# Altium project SRT.PrjPcb
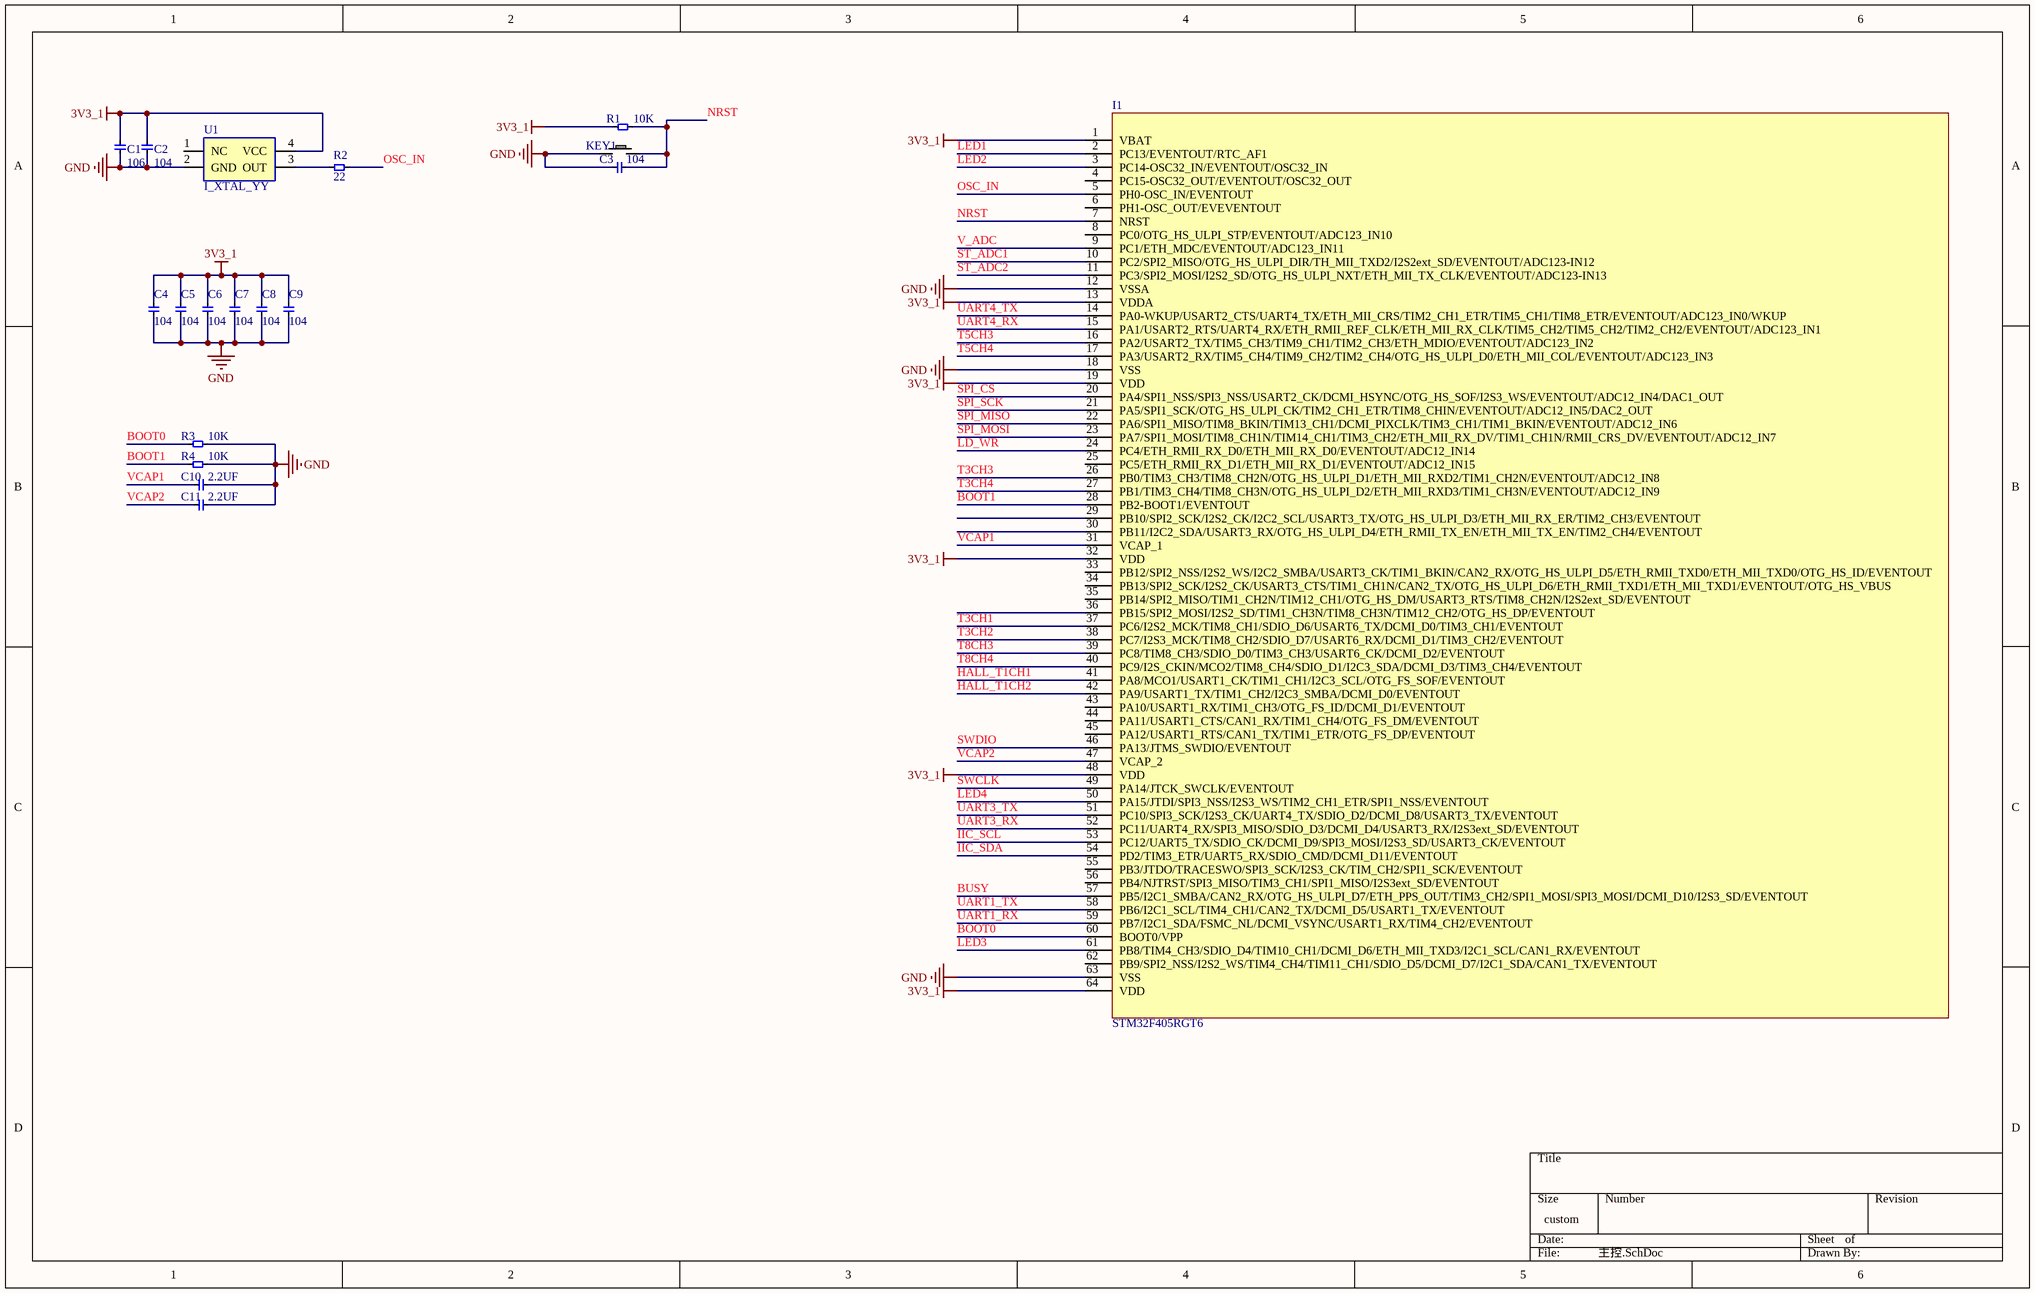
[diagram p0: 主控.SchDoc]
6 sheets, 193 parts. Net scope: global (net labels, ports and power ports of the same name join across sheets).
Board file: Srt.PcbDoc
Sheets:
  主控.SchDoc
  语音识别.SchDoc
  电机,舵机.SchDoc
  其他.SchDoc
  电源.SchDoc
  语音合成.SchDoc

## Sheet 主控.SchDoc
size 381 x 241 mm

### Parts
C1  106  [C_0603]
C2  104  [C_0603]
C3  104  [C_0603]
C4  104  [C_0603]
C5  104  [C_0603]
C6  104  [C_0603]
C7  104  [C_0603]
C8  104  [C_0603]
C9  104  [C_0603]
C10  2.2UF  [C_0603]
C11  2.2UF  [C_0603]
I1  STM32F405RGT6  [I_LQFP-64]
KEY1  KEY  [按键_小四脚]  (value not drawn)
R1  10K  [R_0603]
R2  22  [R_0603]
R3  10K  [R_0603]
R4  10K  [R_0603]
U1  I_XTAL_YY  [I_XTAL_YYSMD_3.2X2.5]

### Nets
3V3_1: C1.2 C2.2 C4.2 C5.2 C6.2 C7.2 C8.2 C9.2 I1.1(VBAT) I1.13(VDDA) I1.19(VDD) I1.32(VDD) I1.48(VDD) I1.64(VDD) R1.1 U1.4(VCC)
GND: C1.1 C2.1 C3.2 C4.1 C5.1 C6.1 C7.1 C8.1 C9.1 C10.1 C11.1 I1.12(VSSA) I1.18(VSS) I1.63(VSS) KEY1.1 R3.2 R4.2 U1.2(GND)
BOOT0: I1.60(BOOT0/VPP) R3.1
BOOT1: I1.28(PB2-BOOT1/EVENTOUT) R4.1
BUSY: I1.57(PB5/I2C1_SMBA/CAN2_RX/OTG_HS_ULPI_D7/ETH_PPS_OUT/TIM3_CH2/SPI1_MOSI/SPI3_MOSI/DCMI_D10/I2S3_SD/EVENTOUT)
HALL_T1CH1: I1.41(PA8/MCO1/USART1_CK/TIM1_CH1/I2C3_SCL/OTG_FS_SOF/EVENTOUT)
HALL_T1CH2: I1.42(PA9/USART1_TX/TIM1_CH2/I2C3_SMBA/DCMI_D0/EVENTOUT)
IIC_SCL: I1.53(PC12/UART5_TX/SDIO_CK/DCMI_D9/SPI3_MOSI/I2S3_SD/USART3_CK/EVENTOUT)
IIC_SDA: I1.54(PD2/TIM3_ETR/UART5_RX/SDIO_CMD/DCMI_D11/EVENTOUT)
LD_WR: I1.24(PC4/ETH_RMII_RX_D0/ETH_MII_RX_D0/EVENTOUT/ADC12_IN14)
LED1: I1.2(PC13/EVENTOUT/RTC_AF1)
LED2: I1.3(PC14-OSC32_IN/EVENTOUT/OSC32_IN)
LED3: I1.61(PB8/TIM4_CH3/SDIO_D4/TIM10_CH1/DCMI_D6/ETH_MII_TXD3/I2C1_SCL/CAN1_RX/EVENTOUT)
LED4: I1.50(PA15/JTDI/SPI3_NSS/I2S3_WS/TIM2_CH1_ETR/SPI1_NSS/EVENTOUT)
NRST: C3.1 I1.7(NRST) KEY1.2 R1.2
OSC_IN: I1.5(PH0-OSC_IN/EVENTOUT) R2.2
SPI_CS: I1.20(PA4/SPI1_NSS/SPI3_NSS/USART2_CK/DCMI_HSYNC/OTG_HS_SOF/I2S3_WS/EVENTOUT/ADC12_IN4/DAC1_OUT)
SPI_MISO: I1.22(PA6/SPI1_MISO/TIM8_BKIN/TIM13_CH1/DCMI_PIXCLK/TIM3_CH1/TIM1_BKIN/EVENTOUT/ADC12_IN6)
SPI_MOSI: I1.23(PA7/SPI1_MOSI/TIM8_CH1N/TIM14_CH1/TIM3_CH2/ETH_MII_RX_DV/TIM1_CH1N/RMII_CRS_DV/EVENTOUT/ADC12_IN7)
SPI_SCK: I1.21(PA5/SPI1_SCK/OTG_HS_ULPI_CK/TIM2_CH1_ETR/TIM8_CHIN/EVENTOUT/ADC12_IN5/DAC2_OUT)
ST_ADC1: I1.10(PC2/SPI2_MISO/OTG_HS_ULPI_DIR/TH_MII_TXD2/I2S2ext_SD/EVENTOUT/ADC123-IN12)
ST_ADC2: I1.11(PC3/SPI2_MOSI/I2S2_SD/OTG_HS_ULPI_NXT/ETH_MII_TX_CLK/EVENTOUT/ADC123-IN13)
SWCLK: I1.49(PA14/JTCK_SWCLK/EVENTOUT)
SWDIO: I1.46(PA13/JTMS_SWDIO/EVENTOUT)
T3CH1: I1.37(PC6/I2S2_MCK/TIM8_CH1/SDIO_D6/USART6_TX/DCMI_D0/TIM3_CH1/EVENTOUT)
T3CH2: I1.38(PC7/I2S3_MCK/TIM8_CH2/SDIO_D7/USART6_RX/DCMI_D1/TIM3_CH2/EVENTOUT)
T3CH3: I1.26(PB0/TIM3_CH3/TIM8_CH2N/OTG_HS_ULPI_D1/ETH_MII_RXD2/TIM1_CH2N/EVENTOUT/ADC12_IN8)
T3CH4: I1.27(PB1/TIM3_CH4/TIM8_CH3N/OTG_HS_ULPI_D2/ETH_MII_RXD3/TIM1_CH3N/EVENTOUT/ADC12_IN9)
T5CH3: I1.16(PA2/USART2_TX/TIM5_CH3/TIM9_CH1/TIM2_CH3/ETH_MDIO/EVENTOUT/ADC123_IN2)
T5CH4: I1.17(PA3/USART2_RX/TIM5_CH4/TIM9_CH2/TIM2_CH4/OTG_HS_ULPI_D0/ETH_MII_COL/EVENTOUT/ADC123_IN3)
T8CH3: I1.39(PC8/TIM8_CH3/SDIO_D0/TIM3_CH3/USART6_CK/DCMI_D2/EVENTOUT)
T8CH4: I1.40(PC9/I2S_CKIN/MCO2/TIM8_CH4/SDIO_D1/I2C3_SDA/DCMI_D3/TIM3_CH4/EVENTOUT)
UART1_RX: I1.59(PB7/I2C1_SDA/FSMC_NL/DCMI_VSYNC/USART1_RX/TIM4_CH2/EVENTOUT)
UART1_TX: I1.58(PB6/I2C1_SCL/TIM4_CH1/CAN2_TX/DCMI_D5/USART1_TX/EVENTOUT)
UART3_RX: I1.52(PC11/UART4_RX/SPI3_MISO/SDIO_D3/DCMI_D4/USART3_RX/I2S3ext_SD/EVENTOUT)
UART3_TX: I1.51(PC10/SPI3_SCK/I2S3_CK/UART4_TX/SDIO_D2/DCMI_D8/USART3_TX/EVENTOUT)
UART4_RX: I1.15(PA1/USART2_RTS/UART4_RX/ETH_RMII_REF_CLK/ETH_MII_RX_CLK/TIM5_CH2/TIM5_CH2/TIM2_CH2/EVENTOUT/ADC123_IN1)
UART4_TX: I1.14(PA0-WKUP/USART2_CTS/UART4_TX/ETH_MII_CRS/TIM2_CH1_ETR/TIM5_CH1/TIM8_ETR/EVENTOUT/ADC123_IN0/WKUP)
V_ADC: I1.9(PC1/ETH_MDC/EVENTOUT/ADC123_IN11)
VCAP1: C10.2 I1.31(VCAP_1)
VCAP2: C11.2 I1.47(VCAP_2)
NetR2_1: R2.1 U1.3(OUT)

Not connected (* = marked no-connect by the designer): I1 4(PC15-OSC32_OUT/EVENTOUT/OSC32_OUT) 6(PH1-OSC_OUT/EVEVENTOUT) 8(PC0/OTG_HS_ULPI_STP/EVENTOUT/ADC123_IN10) 25(PC5/ETH_RMII_RX_D1/ETH_MII_RX_D1/EVENTOUT/ADC12_IN15) 29(PB10/SPI2_SCK/I2S2_CK/I2C2_SCL/USART3_TX/OTG_HS_ULPI_D3/ETH_MII_RX_ER/TIM2_CH3/EVENTOUT) 30(PB11/I2C2_SDA/USART3_RX/OTG_HS_ULPI_D4/ETH_RMII_TX_EN/ETH_MII_TX_EN/TIM2_CH4/EVENTOUT) 33(PB12/SPI2_NSS/I2S2_WS/I2C2_SMBA/USART3_CK/TIM1_BKIN/CAN2_RX/OTG_HS_ULPI_D5/ETH_RMII_TXD0/ETH_MII_TXD0/OTG_HS_ID/EVENTOUT) 34(PB13/SPI2_SCK/I2S2_CK/USART3_CTS/TIM1_CH1N/CAN2_TX/OTG_HS_ULPI_D6/ETH_RMII_TXD1/ETH_MII_TXD1/EVENTOUT/OTG_HS_VBUS) 35(PB14/SPI2_MISO/TIM1_CH2N/TIM12_CH1/OTG_HS_DM/USART3_RTS/TIM8_CH2N/I2S2ext_SD/EVENTOUT) 36(PB15/SPI2_MOSI/I2S2_SD/TIM1_CH3N/TIM8_CH3N/TIM12_CH2/OTG_HS_DP/EVENTOUT) 43(PA10/USART1_RX/TIM1_CH3/OTG_FS_ID/DCMI_D1/EVENTOUT) 44(PA11/USART1_CTS/CAN1_RX/TIM1_CH4/OTG_FS_DM/EVENTOUT) 45(PA12/USART1_RTS/CAN1_TX/TIM1_ETR/OTG_FS_DP/EVENTOUT) 55(PB3/JTDO/TRACESWO/SPI3_SCK/I2S3_CK/TIM_CH2/SPI1_SCK/EVENTOUT) 56(PB4/NJTRST/SPI3_MISO/TIM3_CH1/SPI1_MISO/I2S3ext_SD/EVENTOUT) 62(PB9/SPI2_NSS/I2S2_WS/TIM4_CH4/TIM11_CH1/SDIO_D5/DCMI_D7/I2C1_SDA/CAN1_TX/EVENTOUT); U1 1(NC)

### Library data of the parts
C1-C11 = C_无极贴片: 无极性贴片电容
I1 = I_STM32F405RGT6: LQFP-64
KEY1 = 按键
R1-R4 = R_贴片: 贴片电阻
U1 = I_XTAL_YY: 有源晶振

## Sheet 语音识别.SchDoc
size A4
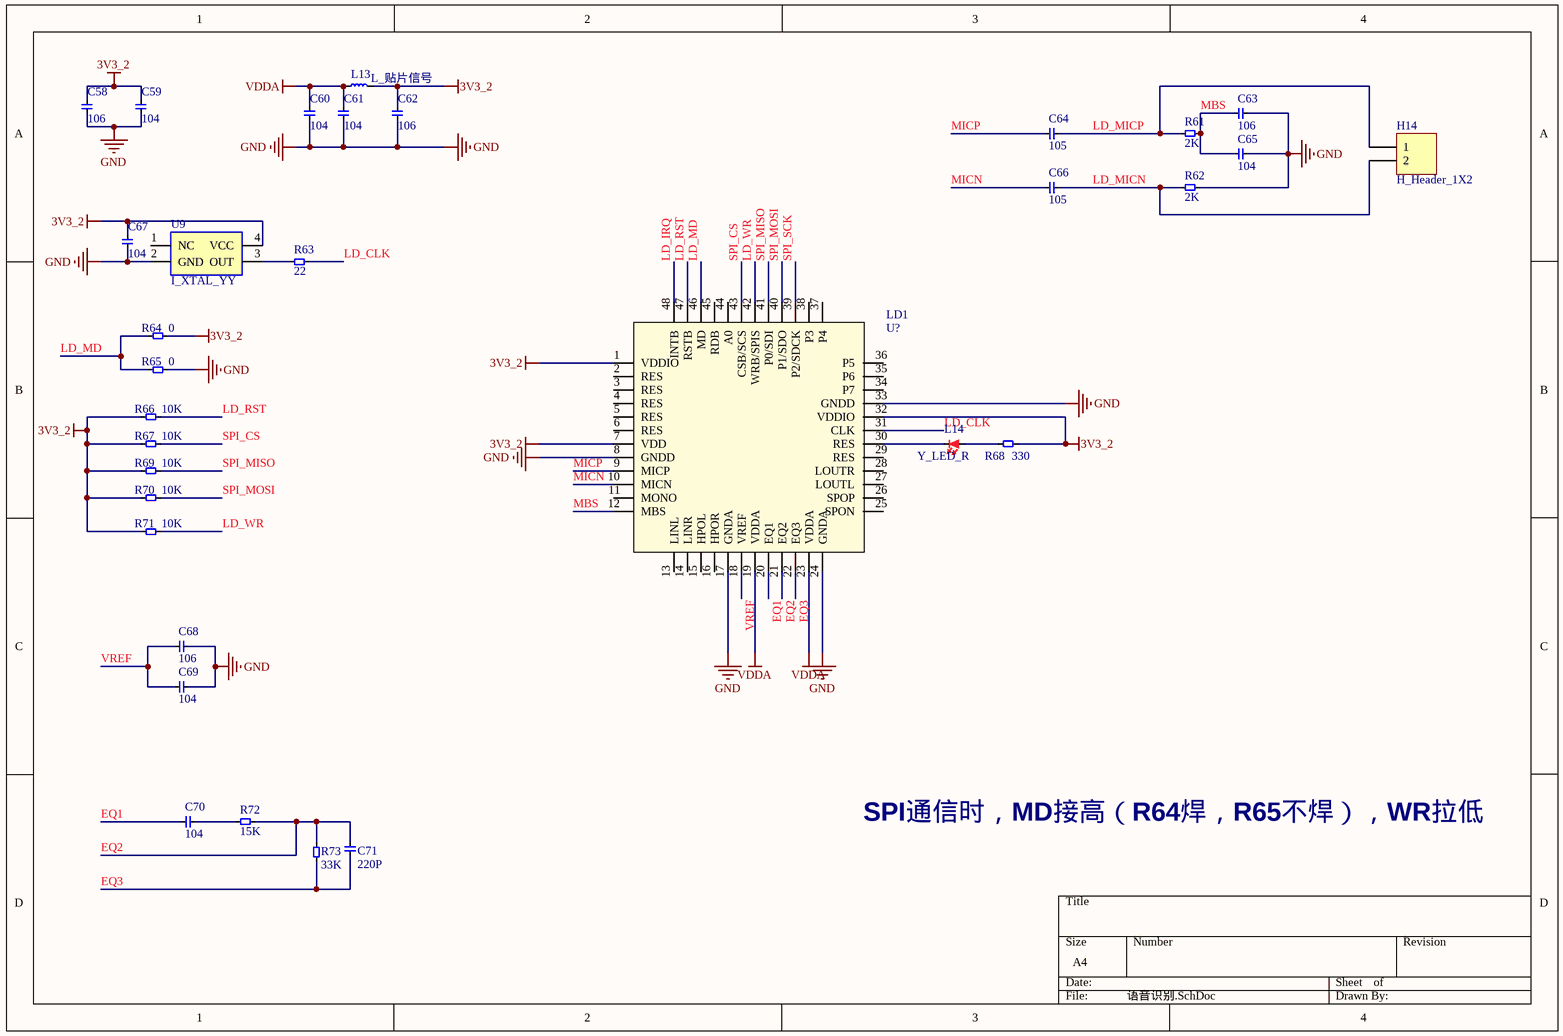
[diagram p1: 语音识别.SchDoc]

### Parts
C58  106  [C_0603]
C59  104  [C_0603]
C60  104  [C_0603]
C61  104  [C_0603]
C62  106  [C_0603]
C63  106  [C_0603]
C64  105  [C_0603]
C65  104  [C_0603]
C66  105  [C_0603]
C67  104  [C_0603]
C68  106  [C_0603]
C69  104  [C_0603]
C70  104  [C_0603]
C71  220P  [C_0603]
H14  H_Header_1X2  [H_Header_1X2]
L13  L_贴片信号  [L_0805]
L14  Y_LED_R  [Y_LED_0805_R]
LD1  U?  [QFN48]
R61  2K  [R_0603]
R62  2K  [R_0603]
R63  22  [R_0603]
R64  0  [R_0603]
R65  0  [R_0603]
R66  10K  [R_0603]
R67  10K  [R_0603]
R68  330  [R_0603]
R69  10K  [R_0603]
R70  10K  [R_0603]
R71  10K  [R_0603]
R72  15K  [R_0603]
R73  33K  [R_0603]
U9  I_XTAL_YY  [I_XTAL_YYSMD_3.2X2.5]

### Nets
3V3_2: C58.2 C59.2 C62.2 C67.2 L13.2 LD1.1(VDDIO) LD1.7(VDD) LD1.32(VDDIO) R64.2 R66.1 R67.1 R68.2 R69.1 R70.1 R71.1 U9.4(VCC)
GND: C58.1 C59.1 C60.1 C61.1 C62.1 C63.2 C65.2 C67.1 C68.1 C69.1 LD1.8(GNDD) LD1.17(GNDA) LD1.24(GNDA) LD1.33(GNDD) R62.2 R65.2 U9.2(GND)
VDDA: C60.2 C61.2 L13.1 LD1.19(VDDA) LD1.23(VDDA)
EQ1: C70.2 LD1.20(EQ1)
EQ2: C71.1 LD1.21(EQ2) R72.2 R73.2
EQ3: C71.2 LD1.22(EQ3) R73.1
LD_CLK: LD1.31(CLK) R63.2
LD_IRQ: LD1.48(INTB)
LD_MD: LD1.46(MD) R64.1 R65.1
LD_MICN: C66.2 H14.2 R62.1
LD_MICP: C64.2 H14.1 R61.1
LD_RST: LD1.47(RSTB) R66.2
LD_WR: LD1.42(WRB/SPIS) R71.2
MBS: C63.1 C65.1 LD1.12(MBS) R61.2
MICN: C66.1 LD1.10(MICN)
MICP: C64.1 LD1.9(MICP)
SPI_CS: LD1.43(CSB/SCS) R67.2
SPI_MISO: LD1.41(P0/SDI) R69.2
SPI_MOSI: LD1.40(P1/SDO) R70.2
SPI_SCK: LD1.39(P2/SDCK)
VREF: C68.2 C69.2 LD1.18(VREF)
NetC70_1: C70.1 R72.1
NetL14_1: L14.1 R68.1
NetL14_2: L14.2 LD1.30(RES)
NetR63_1: R63.1 U9.3(OUT)

Not connected (* = marked no-connect by the designer): LD1 2(RES) 3(RES) 4(RES) 5(RES) 6(RES) 11(MONO) 13(LINL) 14(LINR) 15(HPOL) 16(HPOR) 25(SPON) 26(SPOP) 27(LOUTL) 28(LOUTR) 29(RES) 34(P7) 35(P6) 36(P5) 37(P4) 38(P3) 44(A0) 45(RDB); U9 1(NC)

### Notes on the sheet
- SPI通信时，MD接高（R64焊，R65不焊），WR拉低

### Library data of the parts
C58-C71 = C_无极贴片: 无极性贴片电容
H14 = H_Header_1X2: 单排2针排针; LatestRevisionDate: 17-Jul-2002; LatestRevisionNote: Re-released for DXP Platform.; Publisher: Altium Limited
L13 = L_贴片信号: 贴片信号电感
L14 = Y_LED_R: 红色LED
LD1 = LD3320
R61-R73 = R_贴片: 贴片电阻
U9 = I_XTAL_YY: 有源晶振

## Sheet 电机,舵机.SchDoc
size A4
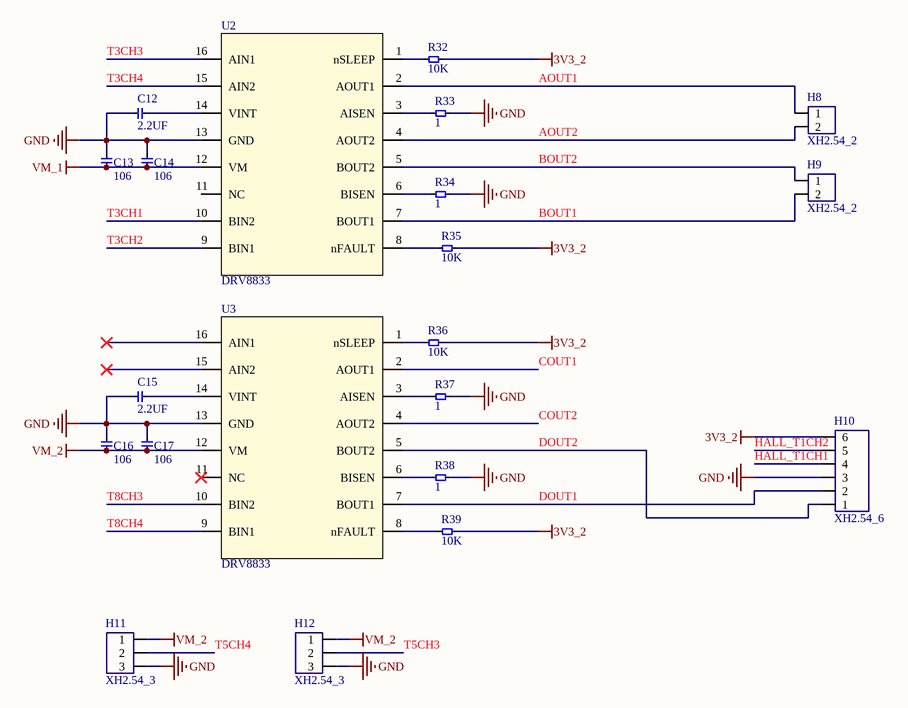
[diagram p2: 电机,舵机.SchDoc]

### Parts
C12  2.2UF  [C_0603]
C13  106  [C_0603]
C14  106  [C_0603]
C15  2.2UF  [C_0603]
C16  106  [C_0603]
C17  106  [C_0603]
H8  XH2.54_2  [H_XH2.54_2]
H9  XH2.54_2  [H_XH2.54_2]
H10  XH2.54_6  [H_XH2.54_6]
H11  XH2.54_3  [H_XH2.54_3]
H12  XH2.54_3  [H_XH2.54_3]
R32  10K  [R_0603]
R33  1  [R_1206]
R34  1  [R_1206]
R35  10K  [R_0603]
R36  10K  [R_0603]
R37  1  [R_1206]
R38  1  [R_1206]
R39  10K  [R_0603]
U2  DRV8833  [SSOP16]
U3  DRV8833  [SSOP16]

### Nets
3V3_2: H10.6 R32.2 R35.2 R36.2 R39.2
GND: C12.2 C13.2 C14.2 C15.2 C16.2 C17.2 H10.3 H11.3 H12.3 R33.2 R34.2 R37.2 R38.2 U2.13(GND) U3.13(GND)
VM_1: C13.1 C14.1 U2.12(VM)
VM_2: C16.1 C17.1 H11.1 H12.1 U3.12(VM)
AOUT1: H8.1 U2.2(AOUT1)
AOUT2: H8.2 U2.4(AOUT2)
BOUT1: H9.2 U2.7(BOUT1)
BOUT2: H9.1 U2.5(BOUT2)
COUT1: U3.2(AOUT1)
COUT2: U3.4(AOUT2)
DOUT1: H10.2 U3.7(BOUT1)
DOUT2: H10.1 U3.5(BOUT2)
HALL_T1CH1: H10.4
HALL_T1CH2: H10.5
T3CH1: U2.10(BIN2)
T3CH2: U2.9(BIN1)
T3CH3: U2.16(AIN1)
T3CH4: U2.15(AIN2)
T5CH3: H12.2
T5CH4: H11.2
T8CH3: U3.10(BIN2)
T8CH4: U3.9(BIN1)
NetC12_1: C12.1 U2.14(VINT)
NetC15_1: C15.1 U3.14(VINT)
NetR32_1: R32.1 U2.1(nSLEEP)
NetR33_1: R33.1 U2.3(AISEN)
NetR34_1: R34.1 U2.6(BISEN)
NetR35_1: R35.1 U2.8(nFAULT)
NetR36_1: R36.1 U3.1(nSLEEP)
NetR37_1: R37.1 U3.3(AISEN)
NetR38_1: R38.1 U3.6(BISEN)
NetR39_1: R39.1 U3.8(nFAULT)

Not connected (* = marked no-connect by the designer): U2 11(NC); U3 11(NC)* 15(AIN2)* 16(AIN1)*

### Library data of the parts
C12-C17 = C_无极贴片: 无极性贴片电容
H8 H9 = H_XH2.54_2: 2脚小白头; LatestRevisionDate: 17-Jul-2002; LatestRevisionNote: Re-released for DXP Platform.; Publisher: Altium Limited
H10 = H_XH2.54_6: 6脚小白头; LatestRevisionDate: 17-Jul-2002; LatestRevisionNote: Re-released for DXP Platform.; Publisher: Altium Limited
H11 H12 = H_XH2.54_3: 3脚小白头; LatestRevisionDate: 17-Jul-2002; LatestRevisionNote: Re-released for DXP Platform.; Publisher: Altium Limited
R32-R39 = R_贴片: 贴片电阻

## Sheet 其他.SchDoc
size A4
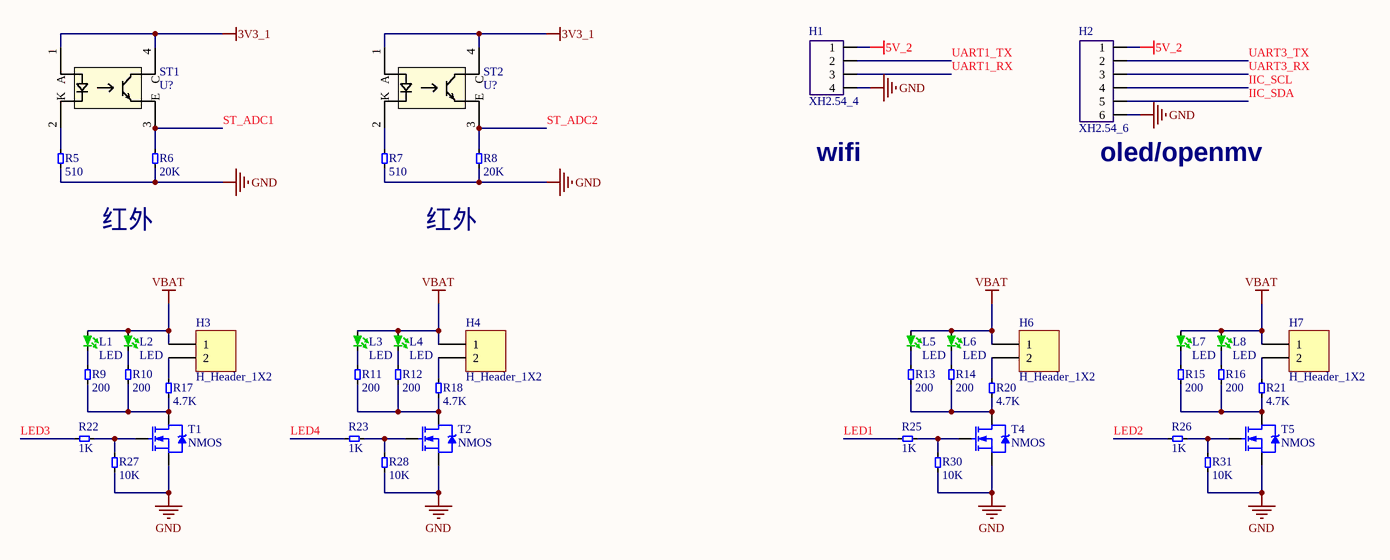
[diagram p3: 其他.SchDoc]

### Parts
H1  XH2.54_4  [H_XH2.54_4]
H2  XH2.54_6  [H_XH2.54_6]
H3  H_Header_1X2  [H_Header_1X2]
H4  H_Header_1X2  [H_Header_1X2]
H6  H_Header_1X2  [H_Header_1X2]
H7  H_Header_1X2  [H_Header_1X2]
L1  LED  [C_1206]
L2  LED  [C_1206]
L3  LED  [C_1206]
L4  LED  [C_1206]
L5  LED  [C_1206]
L6  LED  [C_1206]
L7  LED  [C_1206]
L8  LED  [C_1206]
R5  510  [R_0603]
R6  20K  [R_0603]
R7  510  [R_0603]
R8  20K  [R_0603]
R9  200  [R_0603]
R10  200  [R_0603]
R11  200  [R_0603]
R12  200  [R_0603]
R13  200  [R_0603]
R14  200  [R_0603]
R15  200  [R_0603]
R16  200  [R_0603]
R17  4.7K  [R_0603]
R18  4.7K  [R_0603]
R20  4.7K  [R_0603]
R21  4.7K  [R_0603]
R22  1K  [R_0603]
R23  1K  [R_0603]
R25  1K  [R_0603]
R26  1K  [R_0603]
R27  10K  [R_0603]
R28  10K  [R_0603]
R30  10K  [R_0603]
R31  10K  [R_0603]
ST1  U?  [ST188]
ST2  U?  [ST188]
T1  NMOS  [T_MOS_SOT-23]
T2  NMOS  [T_MOS_SOT-23]
T4  NMOS  [T_MOS_SOT-23]
T5  NMOS  [T_MOS_SOT-23]

### Nets
3V3_1: ST1.1(A) ST1.4(C) ST2.1(A) ST2.4(C)
5V_2: H1.1 H2.1
GND: H1.4 H2.6 R5.1 R6.1 R7.1 R8.1 R27.1 R28.1 R30.1 R31.1 T1.2(S) T2.2(S) T4.2(S) T5.2(S)
VBAT: H3.1 H4.1 H6.1 H7.1 L1.1 L2.1 L3.1 L4.1 L5.1 L6.1 L7.1 L8.1
IIC_SCL: H2.4
IIC_SDA: H2.5
LED1: R25.2
LED2: R26.2
LED3: R22.2
LED4: R23.2
ST_ADC1: R6.2 ST1.3(E)
ST_ADC2: R8.2 ST2.3(E)
UART1_RX: H1.3
UART1_TX: H1.2
UART3_RX: H2.3
UART3_TX: H2.2
NetH3_2: H3.2 R17.2
NetH4_2: H4.2 R18.2
NetH6_2: H6.2 R20.2
NetH7_2: H7.2 R21.2
NetL1_2: L1.2 R9.2
NetL2_2: L2.2 R10.2
NetL3_2: L3.2 R11.2
NetL4_2: L4.2 R12.2
NetL5_2: L5.2 R13.2
NetL6_2: L6.2 R14.2
NetL7_2: L7.2 R15.2
NetL8_2: L8.2 R16.2
NetR5_2: R5.2 ST1.2(K)
NetR7_2: R7.2 ST2.2(K)
NetR9_1: R9.1 R10.1 R17.1 T1.3(D)
NetR11_1: R11.1 R12.1 R18.1 T2.3(D)
NetR13_1: R13.1 R14.1 R20.1 T4.3(D)
NetR15_1: R15.1 R16.1 R21.1 T5.3(D)
NetR22_1: R22.1 R27.2 T1.1(G)
NetR23_1: R23.1 R28.2 T2.1(G)
NetR25_1: R25.1 R30.2 T4.1(G)
NetR26_1: R26.1 R31.2 T5.1(G)

### Notes on the sheet
- (near H1) wifi
- (near H2) oled/openmv
- 红外

### Library data of the parts
H1 = H_XH2.54_4: 4脚小白头; LatestRevisionDate: 17-Jul-2002; LatestRevisionNote: Re-released for DXP Platform.; Publisher: Altium Limited
H2 = H_XH2.54_6: 6脚小白头; LatestRevisionDate: 17-Jul-2002; LatestRevisionNote: Re-released for DXP Platform.; Publisher: Altium Limited
H3 H4 H6 H7 = H_Header_1X2: 单排2针排针; LatestRevisionDate: 17-Jul-2002; LatestRevisionNote: Re-released for DXP Platform.; Publisher: Altium Limited
L1-L8 = Y_LED_G: 绿色LED
R5-R18 R20-R23 R25-R28 R30 R31 = R_贴片: 贴片电阻
ST1 ST2 = ST188
T1 T2 T4 T5 = T_MOSFET_N: N沟道MOS管; Note: Pin 2 is electrically connected to pin 4.; Published: 8-Jun-2000; LatestRevisionDate: 17-Jul-2002; LatestRevisionNote: Re-released for DXP Platform.; DatasheetDocument: PD-9.814; PackageReference: TO-220AB; Publisher: Altium Limited; Code_JEDEC: TO-220-AB

## Sheet 电源.SchDoc
size A4
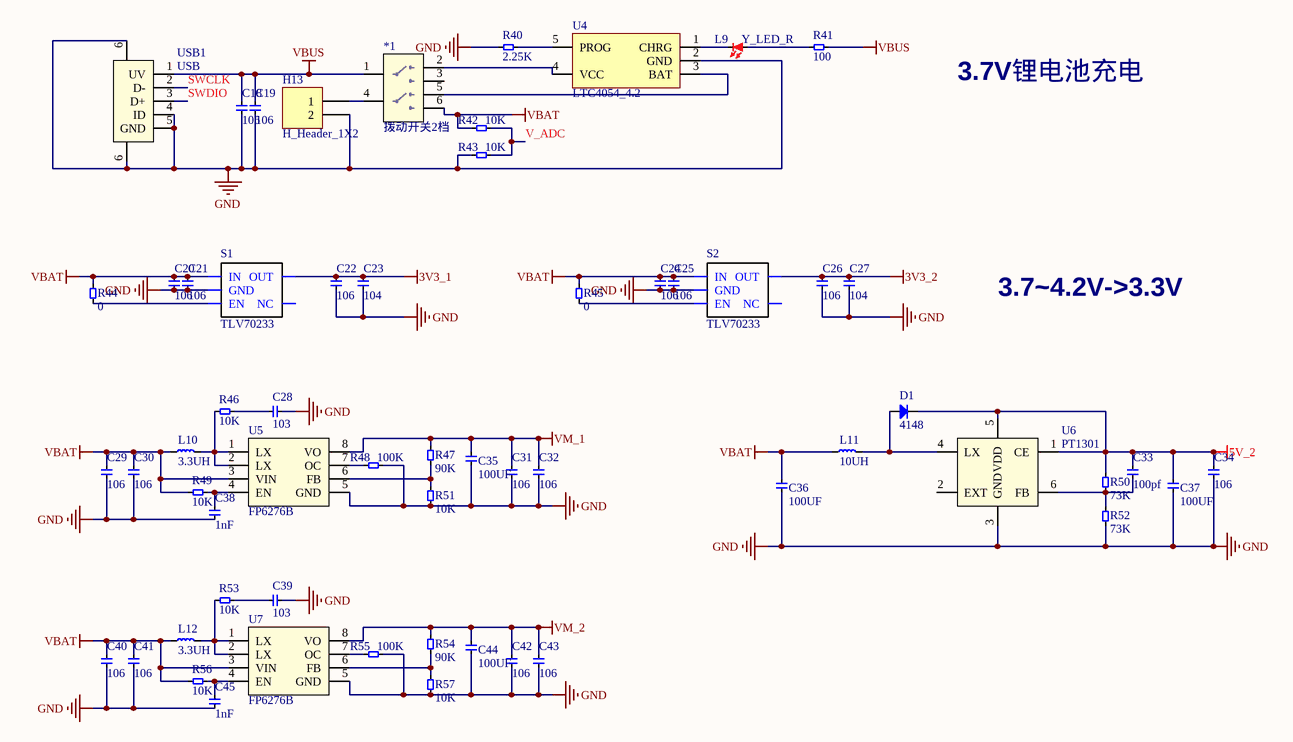
[diagram p4: 电源.SchDoc]

### Parts
*1  拨动开关2档  [拨档开关2x3立式]
C18  106  [C_0603]
C19  106  [C_0603]
C20  106  [C_0603]
C21  106  [C_0603]
C22  106  [C_0603]
C23  104  [C_0603]
C24  106  [C_0603]
C25  106  [C_0603]
C26  106  [C_0603]
C27  104  [C_0603]
C28  103  [C_0603]
C29  106  [C_0603]
C30  106  [C_0603]
C31  106  [C_0603]
C32  106  [C_0603]
C33  100pf  [C_0603]
C34  106  [C_0603]
C35  100UF  [C_1210]
C36  100UF  [C_1210]
C37  100UF  [C_1210]
C38  1nF  [C_0603]
C39  103  [C_0603]
C40  106  [C_0603]
C41  106  [C_0603]
C42  106  [C_0603]
C43  106  [C_0603]
C44  100UF  [C_1210]
C45  1nF  [C_0603]
D1  4148  [1206D]
H13  H_Header_1X2  [H_Header_1X2]
L9  Y_LED_R  [Y_LED_0805_R]
L10  3.3UH  [L_VISHAY_IHLP-1616]
L11  10UH  [L_VISHAY_IHLP-1616]
L12  3.3UH  [L_VISHAY_IHLP-1616]
R40  2.25K  [R_0603]
R41  100  [R_0603]
R42  10K  [R_0603]
R43  10K  [R_0603]
R44  0  [R_0603]
R45  0  [R_0603]
R46  10K  [R_0603]
R47  90K  [R_0603]
R48  100K  [R_0603]
R49  10K  [R_0603]
R50  73K  [R_0603]
R51  10K  [R_0603]
R52  73K  [R_0603]
R53  10K  [R_0603]
R54  90K  [R_0603]
R55  100K  [R_0603]
R56  10K  [R_0603]
R57  10K  [R_0603]
S1  TLV70233  [S_SOT23-5_TLV70233]
S2  TLV70233  [S_SOT23-5_TLV70233]
U4  LTC4054_4.2  [PDSO_G5]
U5  FP6276B  [SOP8]
U6  PT1301  [PDSO_G6]
U7  FP6276B  [SOP8]
USB1  USB  [micro-USB(立式直插）]

### Nets
3V3_1: C22.2 C23.2 S1.5(OUT)
3V3_2: C26.2 C27.2 S2.5(OUT)
5V_2: C33.2 C34.2 C37.2 D1.2(K) R50.2 U6.1(CE) U6.5(VDD)
GND: C18.1 C19.1 C20.1 C21.1 C22.1 C23.1 C24.1 C25.1 C26.1 C27.1 C28.2 C29.1 C30.1 C31.1 C32.1 C34.1 C35.1 C36.1 C37.1 C38.1 C39.2 C40.1 C41.1 C42.1 C43.1 C44.1 C45.1 H13.2 R40.1 R43.1 R48.2 R51.1 R52.1 R55.2 R57.1 S1.2(GND) S2.2(GND) U4.2(GND) U5.5(GND) U6.3(GND) U7.5(GND) USB1.4(ID) USB1.5(GND) USB1.6(G)
VBAT: *1.6 C20.2 C21.2 C24.2 C25.2 C29.2 C30.2 C36.2 C40.2 C41.2 L10.1 L11.1 L12.1 R42.1 R44.2 R45.2 R49.1 R56.1 S1.1(IN) S2.1(IN) U5.3(VIN) U7.3(VIN)
VBUS: *1.1 C18.2 C19.2 R41.2 USB1.1(UV)
VM_1: C31.2 C32.2 C35.2 R47.2 U5.8(VO)
VM_2: C42.2 C43.2 C44.2 R54.2 U7.8(VO)
SWCLK: USB1.2(D-)
SWDIO: USB1.3(D+)
V_ADC: R42.2 R43.2
Net*1_2: *1.2 U4.4(VCC)
Net*1_4: *1.4 H13.1
Net*1_5: *1.5 U4.3(BAT)
NetC28_1: C28.1 R46.2
NetC33_1: C33.1 R50.1 R52.2 U6.6(FB)
NetC38_2: C38.2 R49.2 U5.4(EN)
NetC39_1: C39.1 R53.2
NetC45_2: C45.2 R56.2 U7.4(EN)
NetD1_1: D1.1(A) L11.2 U6.4(LX)
NetL9_1: L9.1 R41.1
NetL9_2: L9.2 U4.1(CHRG)
NetL10_2: L10.2 R46.1 U5.1(LX) U5.2(LX)
NetL12_2: L12.2 R53.1 U7.1(LX) U7.2(LX)
NetR40_2: R40.2 U4.5(PROG)
NetR44_1: R44.1 S1.3(EN)
NetR45_1: R45.1 S2.3(EN)
NetR47_1: R47.1 R51.2 U5.6(FB)
NetR48_1: R48.1 U5.7(OC)
NetR54_1: R54.1 R57.2 U7.6(FB)
NetR55_1: R55.1 U7.7(OC)

Not connected (* = marked no-connect by the designer): *1 3; S1 4(NC); S2 4(NC); U6 2(EXT)

### Notes on the sheet
- 3.7V锂电池充电
- 3.7~4.2V->3.3V

### Library data of the parts
C18-C45 = C_无极贴片: 无极性贴片电容
D1 = diode 4148
H13 = H_Header_1X2: 单排2针排针; LatestRevisionDate: 17-Jul-2002; LatestRevisionNote: Re-released for DXP Platform.; Publisher: Altium Limited
L9 = Y_LED_R: 红色LED
L10-L12 = L_贴片功率: 贴片屏蔽式功率电感
R40-R57 = R_贴片: 贴片电阻
S1 S2 = S_TLV70233: 小封装LDO
U5 U7 = FP6267B

## Sheet 语音合成.SchDoc
size A4
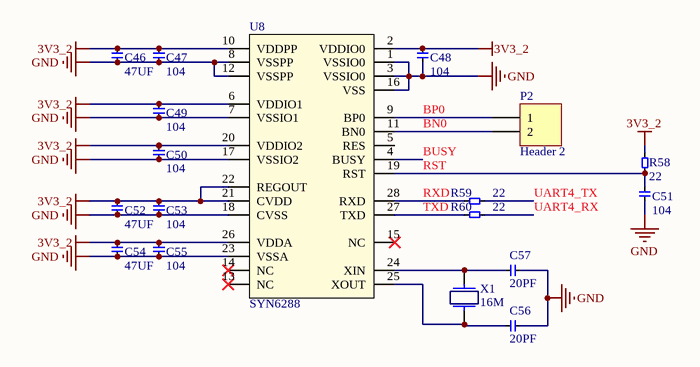
[diagram p5: 语音合成.SchDoc]

### Parts
C46  47UF  [C_1206]
C47  104  [C_0603]
C48  104  [C_0603]
C49  104  [C_0603]
C50  104  [C_0603]
C51  104  [C_0603]
C52  47UF  [C_1206]
C53  104  [C_0603]
C54  47UF  [C_1206]
C55  104  [C_0603]
C56  20PF  [C_0603]
C57  20PF  [C_0603]
P2  Header 2  [HDR1X2]
R58  22  [R_0603]
R59  22  [R_0603]
R60  22  [R_0603]
U8  SYN6288  [SSOP28]
X1  value 16M  [XTAL_DIP]  (hidden comment: xtal)

### Nets
3V3_2: C46.2 C47.2 C48.2 C49.2 C50.2 C52.2 C53.2 C54.2 C55.2 R58.2 U8.2(VDDIO0) U8.6(VDDIO1) U8.10(VDDPP) U8.20(VDDIO2) U8.21(CVDD) U8.22(REGOUT) U8.26(VDDA)
GND: C46.1 C47.1 C48.1 C49.1 C50.1 C51.1 C52.1 C53.1 C54.1 C55.1 C56.2 C57.2 U8.1(VSSIO0) U8.3(VSSIO0) U8.7(VSSIO1) U8.8(VSSPP) U8.12(VSSPP) U8.16(VSS) U8.17(VSSIO2) U8.18(CVSS) U8.23(VSSA)
BN0: P2.2 U8.11(BN0)
BP0: P2.1 U8.9(BP0)
BUSY: U8.4(BUSY)
RST: C51.2 R58.1 U8.19(RST)
RXD: R59.1 U8.28(RXD)
TXD: R60.1 U8.27(TXD)
UART4_RX: R60.2
UART4_TX: R59.2
NetC56_1: C56.1 U8.25(XOUT) X1.2
NetC57_1: C57.1 U8.24(XIN) X1.1

Not connected (* = marked no-connect by the designer): U8 5(RES) 13(NC)* 14(NC)* 15(NC)*

### Library data of the parts
C46-C57 = C_无极贴片: 无极性贴片电容
P2 = Header 2: Header, 2-Pin; LatestRevisionDate: 17-Jul-2002; LatestRevisionNote: Re-released for DXP Platform.; Publisher: Altium Limited
R58-R60 = R_贴片: 贴片电阻

## Nets that join several sheets
3V3_1: 主控 (16 pins), 其他 (ST1.1 ST1.4 ST2.1 ST2.4), 电源 (C22.2 C23.2 S1.5)
3V3_2: 语音识别 (16 pins), 电机,舵机 (5 pins), 电源 (C26.2 C27.2 S2.5), 语音合成 (17 pins)
5V_2: 其他 (H1.1 H2.1), 电源 (7 pins)
GND: 主控 (18 pins), 语音识别 (17 pins), 电机,舵机 (15 pins), 其他 (14 pins), 电源 (44 pins), 语音合成 (21 pins)
VBAT: 其他 (12 pins), 电源 (22 pins)
VM_1: 电机,舵机 (C13.1 C14.1 U2.12), 电源 (5 pins)
VM_2: 电机,舵机 (5 pins), 电源 (5 pins)
BUSY: 主控 (I1.57), 语音合成 (U8.4)
HALL_T1CH1: 主控 (I1.41), 电机,舵机 (H10.4)
HALL_T1CH2: 主控 (I1.42), 电机,舵机 (H10.5)
IIC_SCL: 主控 (I1.53), 其他 (H2.4)
IIC_SDA: 主控 (I1.54), 其他 (H2.5)
LD_WR: 主控 (I1.24), 语音识别 (LD1.42 R71.2)
LED1: 主控 (I1.2), 其他 (R25.2)
LED2: 主控 (I1.3), 其他 (R26.2)
LED3: 主控 (I1.61), 其他 (R22.2)
LED4: 主控 (I1.50), 其他 (R23.2)
SPI_CS: 主控 (I1.20), 语音识别 (LD1.43 R67.2)
SPI_MISO: 主控 (I1.22), 语音识别 (LD1.41 R69.2)
SPI_MOSI: 主控 (I1.23), 语音识别 (LD1.40 R70.2)
SPI_SCK: 主控 (I1.21), 语音识别 (LD1.39)
ST_ADC1: 主控 (I1.10), 其他 (R6.2 ST1.3)
ST_ADC2: 主控 (I1.11), 其他 (R8.2 ST2.3)
SWCLK: 主控 (I1.49), 电源 (USB1.2)
SWDIO: 主控 (I1.46), 电源 (USB1.3)
T3CH1: 主控 (I1.37), 电机,舵机 (U2.10)
T3CH2: 主控 (I1.38), 电机,舵机 (U2.9)
T3CH3: 主控 (I1.26), 电机,舵机 (U2.16)
T3CH4: 主控 (I1.27), 电机,舵机 (U2.15)
T5CH3: 主控 (I1.16), 电机,舵机 (H12.2)
T5CH4: 主控 (I1.17), 电机,舵机 (H11.2)
T8CH3: 主控 (I1.39), 电机,舵机 (U3.10)
T8CH4: 主控 (I1.40), 电机,舵机 (U3.9)
UART1_RX: 主控 (I1.59), 其他 (H1.3)
UART1_TX: 主控 (I1.58), 其他 (H1.2)
UART3_RX: 主控 (I1.52), 其他 (H2.3)
UART3_TX: 主控 (I1.51), 其他 (H2.2)
UART4_RX: 主控 (I1.15), 语音合成 (R60.2)
UART4_TX: 主控 (I1.14), 语音合成 (R59.2)
V_ADC: 主控 (I1.9), 电源 (R42.2 R43.2)